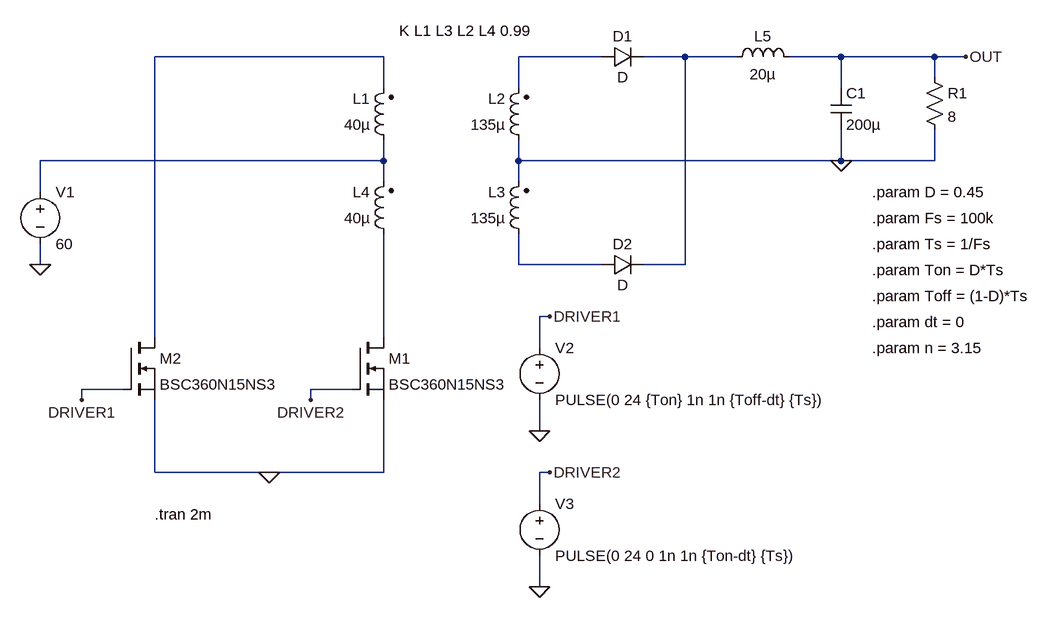
[diagram p0: schematic Draft1.asc]
Draft1.asc, the LTspice schematic file:
Version 4.1
SHEET 1 1504 1012
WIRE 192 16 -160 16
WIRE 528 16 400 16
WIRE 656 16 592 16
WIRE 736 16 656 16
WIRE 896 16 816 16
WIRE 1040 16 896 16
WIRE 1088 16 1040 16
WIRE 1040 48 1040 16
WIRE 192 64 192 16
WIRE 400 64 400 16
WIRE 896 64 896 16
WIRE 192 176 192 144
WIRE 192 176 -336 176
WIRE 400 176 400 144
WIRE 896 176 896 128
WIRE 896 176 400 176
WIRE 1040 176 1040 128
WIRE 1040 176 896 176
WIRE 192 208 192 176
WIRE 400 208 400 176
WIRE -336 224 -336 176
WIRE -336 336 -336 304
WIRE 400 336 400 288
WIRE 528 336 400 336
WIRE 656 336 656 16
WIRE 656 336 592 336
WIRE 448 416 432 416
WIRE -160 448 -160 16
WIRE 192 448 192 288
WIRE 432 464 432 416
WIRE -208 528 -272 528
WIRE 144 528 80 528
WIRE -272 544 -272 528
WIRE 80 544 80 528
WIRE 432 592 432 544
WIRE -160 656 -160 544
WIRE 16 656 -160 656
WIRE 192 656 192 544
WIRE 192 656 16 656
WIRE 448 656 432 656
WIRE 432 704 432 656
WIRE 432 832 432 784
FLAG 1088 16 OUT
FLAG -272 544 DRIVER1
FLAG 80 544 DRIVER2
FLAG -336 336 0
FLAG 432 592 0
FLAG 432 832 0
FLAG 16 656 0
FLAG 896 176 0
FLAG 448 416 DRIVER1
FLAG 448 656 DRIVER2
SYMBOL ind2 208 160 R180
WINDOW 0 36 80 Left 2
WINDOW 3 36 40 Left 2
SYMATTR InstName L1
SYMATTR Value 40µ
SYMBOL ind2 416 160 R180
WINDOW 0 36 80 Left 2
WINDOW 3 36 40 Left 2
SYMATTR InstName L2
SYMATTR Value 135µ
SYMBOL ind2 416 304 R180
WINDOW 0 36 80 Left 2
WINDOW 3 36 40 Left 2
SYMATTR InstName L3
SYMATTR Value 135µ
SYMBOL ind2 208 304 R180
WINDOW 0 36 80 Left 2
WINDOW 3 36 40 Left 2
SYMATTR InstName L4
SYMATTR Value 40µ
SYMBOL nmos 144 448 R0
SYMATTR InstName M1
SYMATTR Value BSC360N15NS3
SYMBOL nmos -208 448 R0
SYMATTR InstName M2
SYMATTR Value BSC360N15NS3
SYMBOL voltage -336 208 R0
SYMATTR InstName V1
SYMATTR Value 60
SYMBOL diode 528 32 R270
WINDOW 0 32 32 VTop 2
WINDOW 3 0 32 VBottom 2
SYMATTR InstName D1
SYMBOL diode 528 352 R270
WINDOW 0 32 32 VTop 2
WINDOW 3 0 32 VBottom 2
SYMATTR InstName D2
SYMBOL ind 720 32 R270
WINDOW 0 32 56 VTop 2
WINDOW 3 5 56 VBottom 2
SYMATTR InstName L5
SYMATTR Value 20µ
SYMBOL cap 880 64 R0
SYMATTR InstName C1
SYMATTR Value 200µ
SYMBOL res 1024 32 R0
SYMATTR InstName R1
SYMATTR Value 8
SYMBOL voltage 432 448 R0
WINDOW 123 0 0 Left 0
WINDOW 39 0 0 Left 0
SYMATTR InstName V2
SYMATTR Value PULSE(0 24 {Ton} 1n 1n {Toff-dt} {Ts})
SYMBOL voltage 432 688 R0
WINDOW 123 0 0 Left 0
WINDOW 39 0 0 Left 0
SYMATTR InstName V3
SYMATTR Value PULSE(0 24 0 1n 1n {Ton-dt} {Ts})
TEXT 944 224 Left 2 !.param D = 0.45
TEXT 944 264 Left 2 !.param Fs = 100k
TEXT 944 304 Left 2 !.param Ts = 1/Fs
TEXT 944 344 Left 2 !.param Ton = D*Ts
TEXT 944 384 Left 2 !.param Toff = (1-D)*Ts
TEXT 944 424 Left 2 !.param dt = 0
TEXT 944 464 Left 2 !.param n = 3.15
TEXT 216 -24 Left 2 !K L1 L3 L2 L4 0.99
TEXT -160 720 Left 2 !.tran 2m

The netlist it stands for:
* Draft1.asc
L1 N004 N001 40µ
L2 0 N002 135µ
L3 N005 0 135µ
L4 N006 N004 40µ
M1 N006 DRIVER2 0 0 BSC360N15NS3
M2 N001 DRIVER1 0 0 BSC360N15NS3
V1 N004 0 60
D1 N002 N003 D
D2 N005 N003 D
L5 N003 OUT 20µ
C1 OUT 0 200µ
R1 OUT 0 8
V2 DRIVER1 0 PULSE(0 24 {Ton} 1n 1n {Toff-dt} {Ts})
V3 DRIVER2 0 PULSE(0 24 0 1n 1n {Ton-dt} {Ts})
.model D D
.lib standard.dio
.model NMOS NMOS
.model PMOS PMOS
.lib standard.mos
.param D = 0.45
.param Fs = 100k
.param Ts = 1/Fs
.param Ton = D*Ts
.param Toff = (1-D)*Ts
.param dt = 0
.param n = 3.15
K L1 L3 L2 L4 0.99
.tran 2m
.backanno
.end